# Altium schematic sheet High_Level_uC_Board.SchDoc
size A
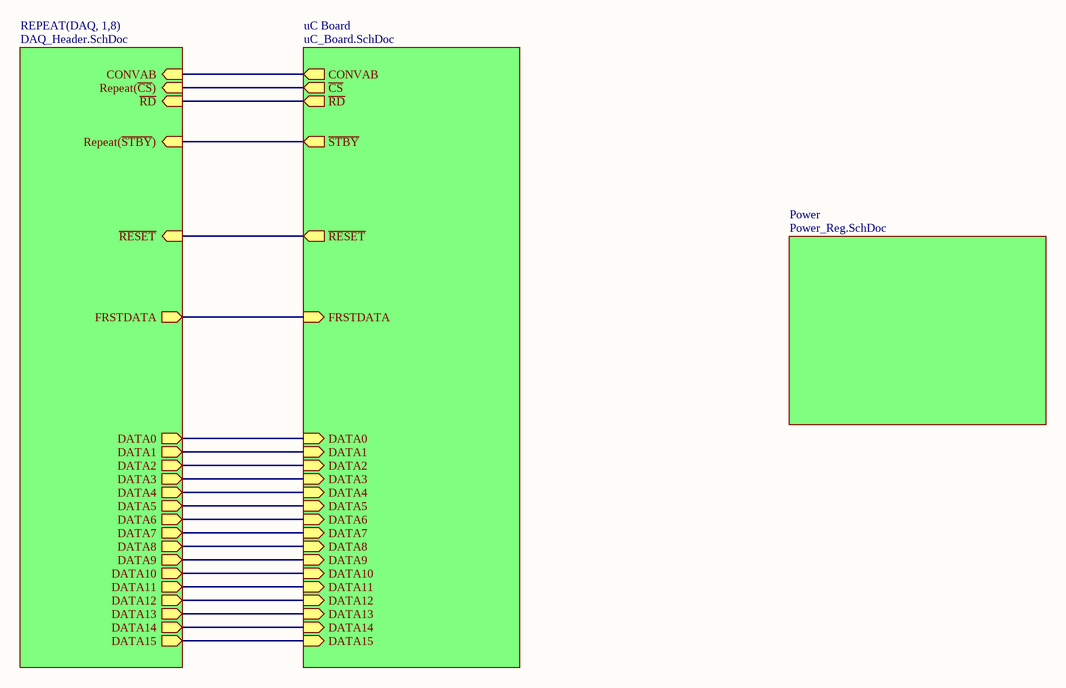
[diagram p0: High_Level_uC_Board.SchDoc]

## Sub-sheets
Power = Power_Reg.SchDoc: no entries
REPEAT(DAQ, 1,8) = DAQ_Header.SchDoc: CONVAB (in), Repeat(~{CS}) (in), ~{RD} (in), Repeat(~{STBY}) (in), ~{RESET} (in), FRSTDATA (out), DATA0 (out), DATA1 (out), DATA2 (out), DATA3 (out), DATA4 (out), DATA5 (out), DATA6 (out), DATA7 (out), DATA8 (out), DATA9 (out), DATA10 (out), DATA11 (out), DATA12 (out), DATA13 (out), DATA14 (out), DATA15 (out)
uC Board = uC_Board.SchDoc: CONVAB (out), ~{CS} (out), ~{RD} (out), ~{STBY} (out), ~{RESET} (out), FRSTDATA (in), DATA0 (in), DATA1 (in), DATA2 (in), DATA3 (in), DATA4 (in), DATA5 (in), DATA6 (in), DATA7 (in), DATA8 (in), DATA9 (in), DATA10 (in), DATA11 (in), DATA12 (in), DATA13 (in), DATA14 (in), DATA15 (in)

## Nets
(unnamed): sheet uC Board/CONVAB, sheet REPEAT(DAQ, 1,8)/CONVAB
(unnamed): sheet uC Board/~{CS}, sheet REPEAT(DAQ, 1,8)/Repeat(~{CS})
(unnamed): sheet uC Board/~{RD}, sheet REPEAT(DAQ, 1,8)/~{RD}
(unnamed): sheet uC Board/~{STBY}, sheet REPEAT(DAQ, 1,8)/Repeat(~{STBY})
(unnamed): sheet uC Board/~{RESET}, sheet REPEAT(DAQ, 1,8)/~{RESET}
(unnamed): sheet uC Board/FRSTDATA, sheet REPEAT(DAQ, 1,8)/FRSTDATA
(unnamed): sheet uC Board/DATA0, sheet REPEAT(DAQ, 1,8)/DATA0
(unnamed): sheet uC Board/DATA1, sheet REPEAT(DAQ, 1,8)/DATA1
(unnamed): sheet uC Board/DATA2, sheet REPEAT(DAQ, 1,8)/DATA2
(unnamed): sheet uC Board/DATA3, sheet REPEAT(DAQ, 1,8)/DATA3
(unnamed): sheet uC Board/DATA4, sheet REPEAT(DAQ, 1,8)/DATA4
(unnamed): sheet uC Board/DATA5, sheet REPEAT(DAQ, 1,8)/DATA5
(unnamed): sheet uC Board/DATA6, sheet REPEAT(DAQ, 1,8)/DATA6
(unnamed): sheet uC Board/DATA7, sheet REPEAT(DAQ, 1,8)/DATA7
(unnamed): sheet uC Board/DATA8, sheet REPEAT(DAQ, 1,8)/DATA8
(unnamed): sheet uC Board/DATA9, sheet REPEAT(DAQ, 1,8)/DATA9
(unnamed): sheet uC Board/DATA10, sheet REPEAT(DAQ, 1,8)/DATA10
(unnamed): sheet uC Board/DATA11, sheet REPEAT(DAQ, 1,8)/DATA11
(unnamed): sheet uC Board/DATA12, sheet REPEAT(DAQ, 1,8)/DATA12
(unnamed): sheet uC Board/DATA13, sheet REPEAT(DAQ, 1,8)/DATA13
(unnamed): sheet uC Board/DATA14, sheet REPEAT(DAQ, 1,8)/DATA14
(unnamed): sheet uC Board/DATA15, sheet REPEAT(DAQ, 1,8)/DATA15